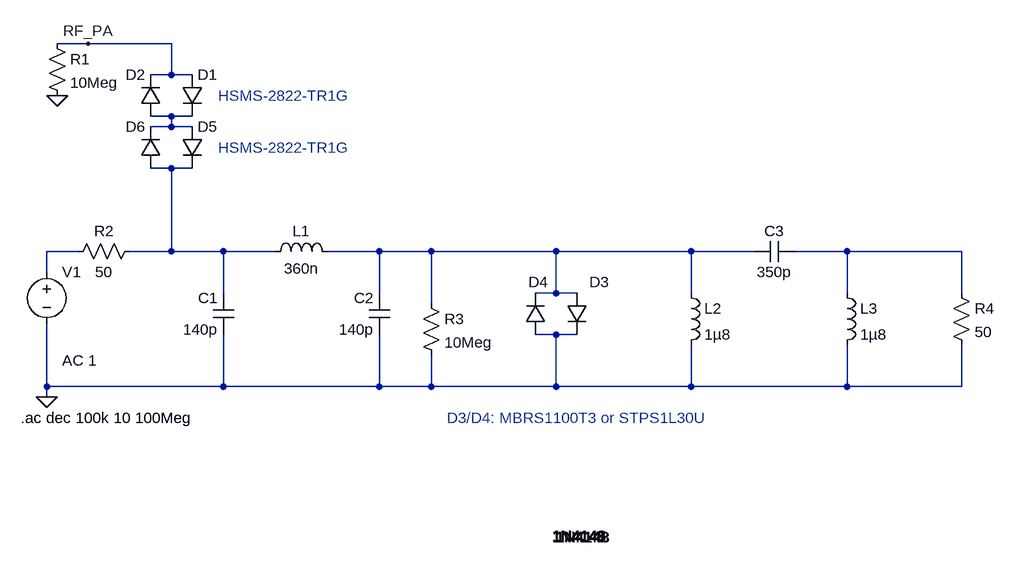
[diagram p0: schematic 22MHz Passive Switch.asc]
22MHz Passive Switch.asc, the LTspice schematic file:
Version 4
SHEET 1 1064 772
WIRE -336 -176 -384 -176
WIRE -208 -176 -336 -176
WIRE -208 -128 -208 -176
WIRE -208 -128 -240 -128
WIRE -176 -128 -208 -128
WIRE -208 -64 -240 -64
WIRE -176 -64 -208 -64
WIRE -208 -48 -208 -64
WIRE -208 -48 -240 -48
WIRE -176 -48 -208 -48
WIRE -208 16 -240 16
WIRE -176 16 -208 16
WIRE -352 144 -400 144
WIRE -208 144 -208 16
WIRE -208 144 -272 144
WIRE -128 144 -208 144
WIRE -48 144 -128 144
WIRE 112 144 32 144
WIRE 192 144 112 144
WIRE 384 144 192 144
WIRE 592 144 384 144
WIRE 688 144 592 144
WIRE 832 144 752 144
WIRE 1008 144 832 144
WIRE -400 176 -400 144
WIRE -128 208 -128 144
WIRE 112 208 112 144
WIRE 384 208 384 144
WIRE 384 208 352 208
WIRE 416 208 384 208
WIRE 592 208 592 144
WIRE 832 208 832 144
WIRE 1008 208 1008 144
WIRE 192 224 192 144
WIRE 384 272 352 272
WIRE 416 272 384 272
WIRE -400 352 -400 256
WIRE -128 352 -128 272
WIRE -128 352 -400 352
WIRE 112 352 112 272
WIRE 112 352 -128 352
WIRE 192 352 192 304
WIRE 192 352 112 352
WIRE 384 352 384 272
WIRE 384 352 192 352
WIRE 592 352 592 288
WIRE 592 352 384 352
WIRE 832 352 832 288
WIRE 832 352 592 352
WIRE 1008 352 1008 288
WIRE 1008 352 832 352
WIRE -400 368 -400 352
FLAG -400 368 0
FLAG -336 -176 RF_PA
FLAG -384 -96 0
SYMBOL ind -64 160 R270
WINDOW 0 32 56 VTop 2
WINDOW 3 5 56 VBottom 2
SYMATTR InstName L1
SYMATTR Value 360n
SYMATTR SpiceLine Rser=0.3
SYMBOL cap -112 272 R180
WINDOW 0 24 56 Left 2
WINDOW 3 24 8 Left 2
SYMATTR InstName C1
SYMATTR Value 140p
SYMATTR SpiceLine Rser=0.1
SYMBOL voltage -400 160 R0
WINDOW 123 24 152 Left 2
WINDOW 39 24 124 Left 2
SYMATTR Value2 AC 1
SYMATTR InstName V1
SYMATTR Value ""
SYMBOL res -256 128 R90
WINDOW 0 0 56 VBottom 2
WINDOW 3 32 56 VTop 2
SYMATTR InstName R2
SYMATTR Value 50
SYMBOL cap 128 272 R180
WINDOW 0 24 56 Left 2
WINDOW 3 24 8 Left 2
SYMATTR InstName C2
SYMATTR Value 140p
SYMATTR SpiceLine Rser=0.1
SYMBOL res 176 208 R0
SYMATTR InstName R3
SYMATTR Value 10Meg
SYMBOL diode -192 -128 R0
WINDOW 3 571 710 Left 2
SYMATTR InstName D1
SYMATTR Value 1N4148
SYMATTR Description Schottky diode
SYMATTR Type schottky
SYMBOL diode -224 -64 R180
WINDOW 0 24 64 Left 2
WINDOW 3 -687 -647 Left 2
SYMATTR InstName D2
SYMATTR Value 1N4148
SYMATTR Description Schottky diode
SYMATTR Type schottky
SYMBOL res -400 -192 R0
SYMATTR InstName R1
SYMATTR Value 10Meg
SYMBOL diode 400 208 R0
WINDOW 0 35 -17 Left 2
WINDOW 3 -22 376 Left 2
SYMATTR InstName D3
SYMATTR Value 1N4148
SYMATTR Description Schottky diode
SYMATTR Type schottky
SYMBOL diode 368 272 R180
WINDOW 0 -4 81 Left 2
WINDOW 3 -101 -312 Left 2
SYMATTR InstName D4
SYMATTR Value 1N4148
SYMATTR Description Schottky diode
SYMATTR Type schottky
SYMBOL ind 576 192 R0
SYMATTR InstName L2
SYMATTR Value 1µ8
SYMATTR SpiceLine Rser=0.3
SYMBOL ind 816 192 R0
SYMATTR InstName L3
SYMATTR Value 1µ8
SYMATTR SpiceLine Rser=0.3
SYMBOL cap 688 160 R270
WINDOW 0 32 32 VTop 2
WINDOW 3 0 32 VBottom 2
SYMATTR InstName C3
SYMATTR Value 350p
SYMATTR SpiceLine Rser=0.1
SYMBOL res 992 192 R0
SYMATTR InstName R4
SYMATTR Value 50
SYMBOL diode -192 -48 R0
WINDOW 3 575 631 Left 2
SYMATTR InstName D5
SYMATTR Value 1N4148
SYMATTR Description Schottky diode
SYMATTR Type schottky
SYMBOL diode -224 16 R180
WINDOW 0 24 64 Left 2
WINDOW 3 -686 -566 Left 2
SYMATTR InstName D6
SYMATTR Value 1N4148
SYMATTR Description Schottky diode
SYMATTR Type schottky
TEXT -440 400 Left 2 !.ac dec 100k 10 100Meg
TEXT -136 -96 Left 2 ;HSMS-2822-TR1G
TEXT -136 -16 Left 2 ;HSMS-2822-TR1G
TEXT 216 400 Left 2 ;D3/D4: MBRS1100T3 or STPS1L30U

The netlist it stands for:
* 22MHz Passive Switch.asc
L1 N002 N004 360n Rser=0.3
C1 0 N002 140p Rser=0.1
V1 N003 0 AC 1
R2 N002 N003 50
C2 0 N004 140p Rser=0.1
R3 N004 0 10Meg
D1 RF_PA N001 1N4148
D2 N001 RF_PA 1N4148
R1 RF_PA 0 10Meg
D3 N004 0 1N4148
D4 0 N004 1N4148
L2 N004 0 1µ8 Rser=0.3
L3 N005 0 1µ8 Rser=0.3
C3 N004 N005 350p Rser=0.1
R4 N005 0 50
D5 N001 N002 1N4148
D6 N002 N001 1N4148
.model D D
.lib standard.dio
.ac dec 100k 10 100Meg
* HSMS-2822-TR1G
* HSMS-2822-TR1G
* D3/D4: MBRS1100T3 or STPS1L30U
.backanno
.end